# Altium schematic sheet IR LEDS.SchDoc
size A4; DocumentNumber: 6; SheetNumber: ALT0056; SheetTotal: 21
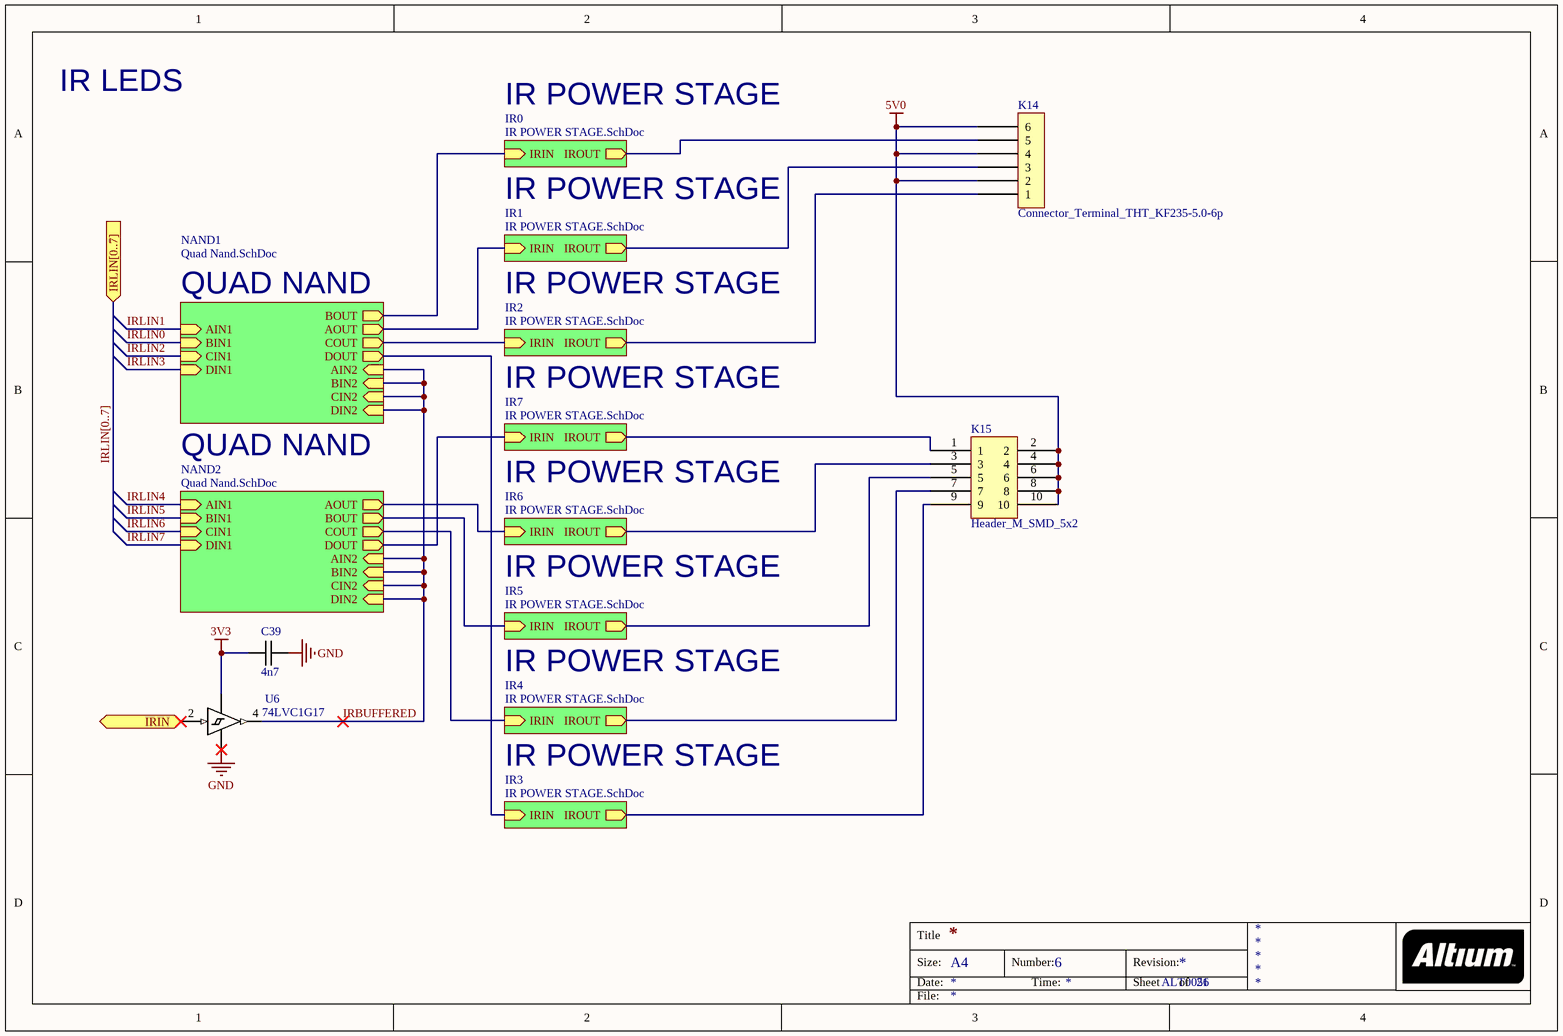
[diagram p0: IR LEDS.SchDoc]

## Parts
C39  4n7  [0603C-TBD]
K14  Connector_Terminal_THT_KF235-5.0-6p  [KF235-5.0-6p]
K15  Header_M_SMD_5x2  [Header_Male_2.54 5x2]
U6  74LVC1G17  [SOT-353]

## Sub-sheets
IR0 = IR POWER STAGE.SchDoc: IROUT (out), IRIN (in)
IR1 = IR POWER STAGE.SchDoc: IROUT (out), IRIN (in)
IR2 = IR POWER STAGE.SchDoc: IROUT (out), IRIN (in)
IR3 = IR POWER STAGE.SchDoc: IROUT (out), IRIN (in)
IR4 = IR POWER STAGE.SchDoc: IROUT (out), IRIN (in)
IR5 = IR POWER STAGE.SchDoc: IROUT (out), IRIN (in)
IR6 = IR POWER STAGE.SchDoc: IROUT (out), IRIN (in)
IR7 = IR POWER STAGE.SchDoc: IROUT (out), IRIN (in)
NAND1 = Quad Nand.SchDoc: BIN1 (in), BIN2 (in), BOUT (out), CIN1 (in), CIN2 (in), DIN1 (in), DIN2 (in), AIN1 (in), AIN2 (in), COUT (out), DOUT (out), AOUT (out)
NAND2 = Quad Nand.SchDoc: BIN1 (in), BIN2 (in), BOUT (out), CIN1 (in), CIN2 (in), DIN1 (in), DIN2 (in), AIN1 (in), AIN2 (in), COUT (out), DOUT (out), AOUT (out)

## Ports
IRIN (in), IRLIN[0..7] (in)

## Nets
3V3: C39.1 U6.5(VCC)
5V0: K14.2 K14.4 K14.6 K15.2 K15.4 K15.6 K15.8 K15.10
GND: C39.2 U6.3(GND)
IRBUFFERED: U6.4(Y) ; sheet NAND1/BIN2, sheet NAND1/CIN2, sheet NAND1/DIN2, sheet NAND1/AIN2, sheet NAND2/BIN2, sheet NAND2/CIN2, sheet NAND2/DIN2, sheet NAND2/AIN2
IRIN: U6.2(A) ; port IRIN
IRLIN0: sheet NAND1/BIN1
IRLIN1: sheet NAND1/AIN1
IRLIN2: sheet NAND1/CIN1
IRLIN3: sheet NAND1/DIN1
IRLIN4: sheet NAND2/AIN1
IRLIN5: sheet NAND2/BIN1
IRLIN6: sheet NAND2/CIN1
IRLIN7: sheet NAND2/DIN1
NetK14_1: K14.1 ; sheet IR2/IROUT
NetK14_3: K14.3 ; sheet IR1/IROUT
NetK14_5: K14.5 ; sheet IR0/IROUT
NetK15_1: K15.1 ; sheet IR7/IROUT
NetK15_3: K15.3 ; sheet IR6/IROUT
NetK15_5: K15.5 ; sheet IR5/IROUT
NetK15_7: K15.7 ; sheet IR4/IROUT
NetK15_9: K15.9 ; sheet IR3/IROUT
(unnamed): sheet NAND1/BOUT, sheet IR0/IRIN
(unnamed): sheet NAND1/COUT, sheet IR2/IRIN
(unnamed): sheet NAND1/DOUT, sheet IR3/IRIN
(unnamed): sheet NAND1/AOUT, sheet IR1/IRIN
(unnamed): sheet NAND2/BOUT, sheet IR5/IRIN
(unnamed): sheet NAND2/COUT, sheet IR4/IRIN
(unnamed): sheet NAND2/DOUT, sheet IR7/IRIN
(unnamed): sheet NAND2/AOUT, sheet IR6/IRIN

## Buses and harness runs
bus IRLIN[0..7] = port IRLIN[0..7]

## Notes on the sheet
- IR LEDS
- IR POWER STAGE
- QUAD NAND
- Title
- Size:
- Date:
- A4
- Number:
- Time:
- Revision:
- Sheet
- of
- File:

## Library data of the parts
C39 = 0603C-4N7: CAPACITOR 0603 CERAMIC; REEL: C83; Supplier 1: Digi-Key; Supplier Part Number 1: 445-5086-2-ND
K15 = Header_M_SMD_5x2: SMD Header 5x2
U6 = 74LVC1G17: Single buffer